# Altium schematic sheet 底座.SchDoc
size A4
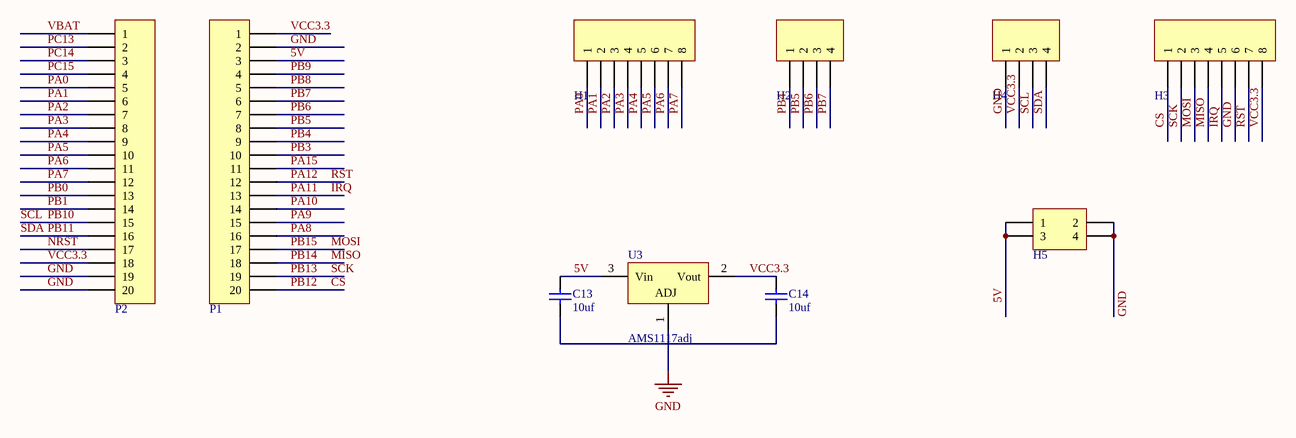
[diagram p0: 底座.SchDoc]

## Parts
C13  (no value)  [0603C]
C14  (no value)  [0603C]
H1  Header 8  [HDR1X8]  (value not drawn)
H2  Header 4  [HDR1X4]  (value not drawn)
H3  Header 8  [HDR1X8]  (value not drawn)
H4  Header 4  [HDR1X4]  (value not drawn)
H5  Header 2X2  [HDR2X2]  (value not drawn)
P1  Header 20  [HDR1X20]  (value not drawn)
P2  Header 20  [HDR1X20]  (value not drawn)
U3  AMS1117adj  [SOT223]

## Nets
GND: H3.6 H4.1 H5.2 H5.4 P1.2 P2.19 P2.20 U3.1(ADJ)
5V: C13.1 H5.1 H5.3 P1.3 U3.3(Vin)
CS: H3.1 P1.20  [also labelled PB12]
IRQ: H3.5 P1.13  [also labelled PA11]
MISO: H3.4 P1.18  [also labelled PB14]
MOSI: H3.3 P1.17  [also labelled PB15]
NRST: P2.17
PA0: H1.1 P2.5
PA1: H1.2 P2.6
PA2: H1.3 P2.7
PA3: H1.4 P2.8
PA4: H1.5 P2.9
PA5: H1.6 P2.10
PA6: H1.7 P2.11
PA7: H1.8 P2.12
PA8: P1.16
PA9: P1.15
PA10: P1.14
PA12: H3.7 P1.12  [also labelled RST]
PA15: P1.11
PB0: P2.13
PB1: P2.14
PB3: P1.10
PB4: H2.1 P1.9
PB5: H2.2 P1.8
PB6: H2.3 P1.7
PB7: H2.4 P1.6
PB8: P1.5
PB9: P1.4
PB10: H4.3 P2.15  [also labelled SCL]
PB11: H4.4 P2.16  [also labelled SDA]
PB13: H3.2 P1.19  [also labelled SCK]
PC13: P2.2
PC14: P2.3
PC15: P2.4
VBAT: P2.1
VCC3.3: C14.1 H3.8 H4.2 P1.1 P2.18 U3.2(Vout)
NetC13_2: C13.2 C14.2

## Notes on the sheet
- (in symbol Cap_0603) 10uf

## Library data of the parts
C13 C14 = Cap_0603: 0603瓷片电容
H1 H3 = Header 8: Header, 8-Pin; LatestRevisionDate: 17-Jul-2002; LatestRevisionNote: Re-released for DXP Platform.; Publisher: Altium Limited
H2 H4 = Header 4: Header, 4-Pin; LatestRevisionDate: 17-Jul-2002; LatestRevisionNote: Re-released for DXP Platform.; Publisher: Altium Limited
H5 = Header 2X2: Header, 2-Pin, Dual row; LatestRevisionDate: 17-Jul-2002; LatestRevisionNote: Re-released for DXP Platform.; Publisher: Altium Limited
P1 P2 = Header 20: Header, 20-Pin; LatestRevisionDate: 17-Jul-2002; LatestRevisionNote: Re-released for DXP Platform.; Publisher: Altium Limited
U3 = AMS1117adj: 三端稳压芯片可调输出